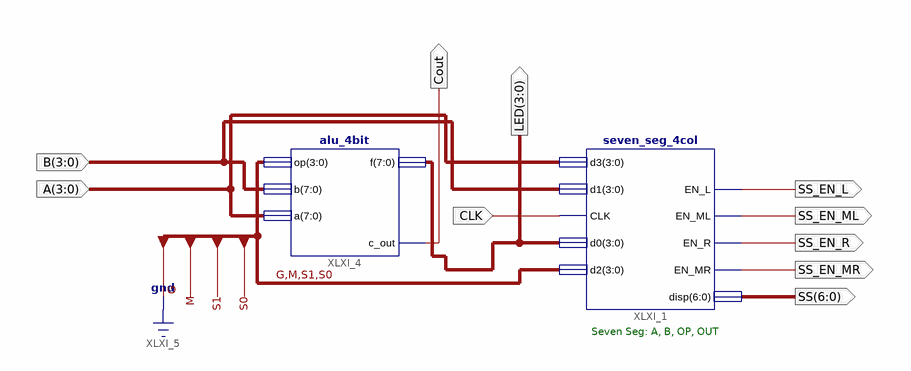
[diagram p0: schematic sheet 1]
// Xilinx ISE schematic main_lab_fast.sch (spartan3e) as structural Verilog: 2 symbols, 10 ports
module main_lab_fast (
  input  [3:0] A,
  input  CLK,
  input  [3:0] B,
  output [6:0] SS,
  output SS_EN_MR,
  output SS_EN_R,
  output SS_EN_ML,
  output SS_EN_L,
  output Cout,
  output [3:0] LED
);

  wire M, S0, S1;

  seven_seg_4col XLXI_1 (
    .d3(A), .d1(B), .CLK(CLK), .d0(LED), .d2({1'b0, M, S1, S0}), .disp(SS), .EN_L(SS_EN_L), .EN_ML(SS_EN_ML),
    .EN_R(SS_EN_R), .EN_MR(SS_EN_MR));
  alu_4bit XLXI_4 (.op({1'b0, M, S1, S0}), .b(B), .a(A), .f(LED), .c_out(Cout));

  // Notes on the sheet:
  //   Seven Seg: A, B, OP, OUT
endmodule
